# Altium schematic sheet Decawave.SchDoc
size A
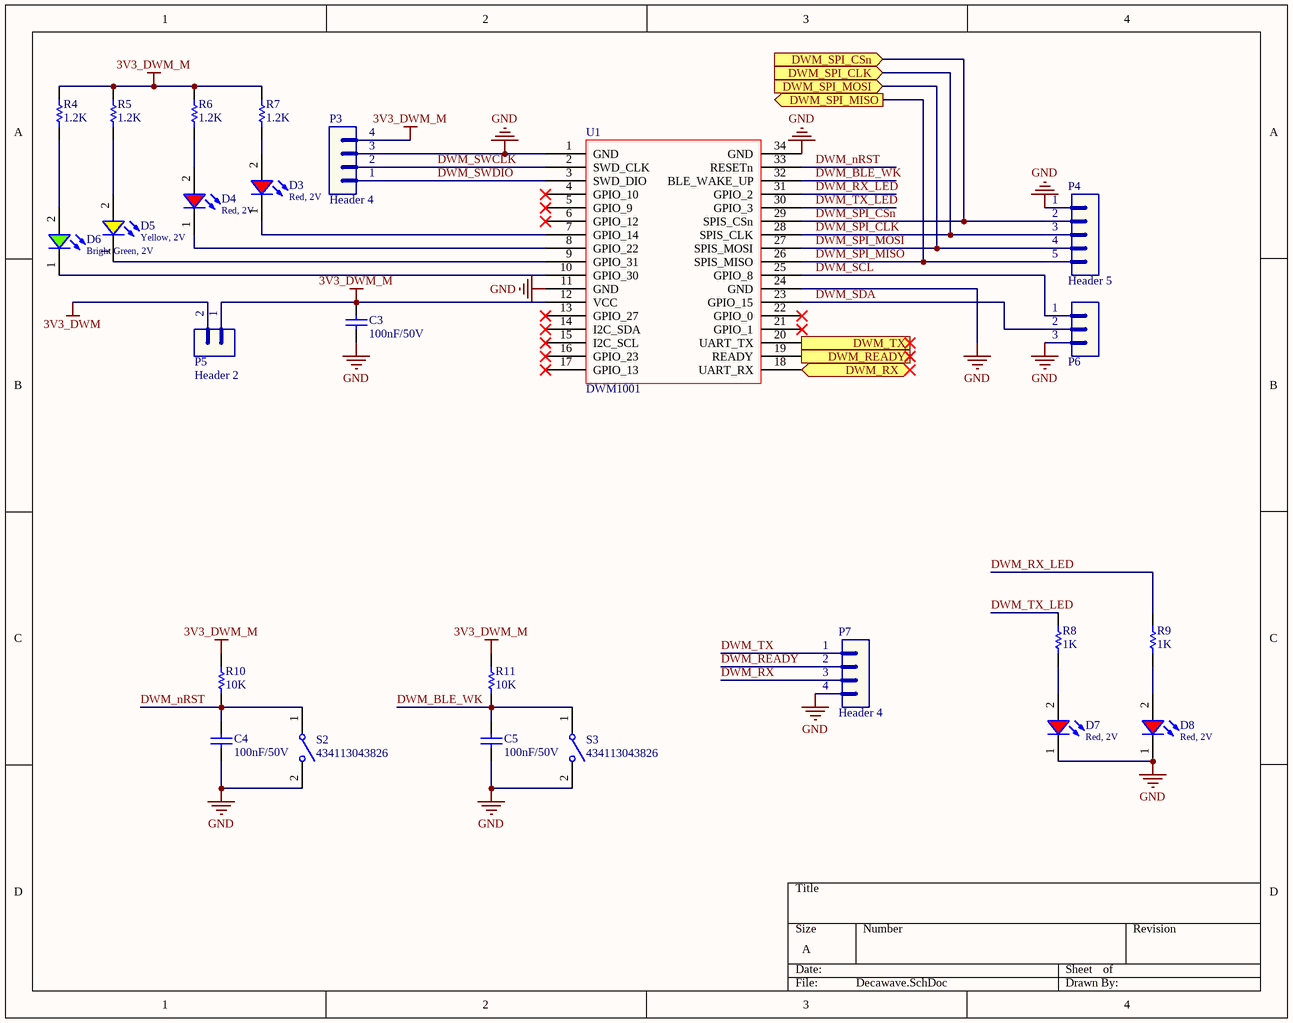
[diagram p0: Decawave.SchDoc]

## Parts
C3  value 100nF/50V  [CAP-SM-0805]  (hidden comment: Cap-100nF-50V-0805)
C4  value 100nF/50V  [CAP-SM-0805]  (hidden comment: Cap-100nF-50V-0805)
C5  value 100nF/50V  [CAP-SM-0805]  (hidden comment: Cap-100nF-50V-0805)
D3  Red, 2V  [WL-SMCW_0805]
D4  Red, 2V  [WL-SMCW_0805]
D5  Yellow, 2V  [WL-SMCW_0805]
D6  Bright Green, 2V  [WL-SMCW_0805]
D7  Red, 2V  [WL-SMCW_0805]
D8  Red, 2V  [WL-SMCW_0805]
P3  Header 4  [JP4]
P4  Header 5  [JP5]
P5  Header 2  [JP2]
P6  Header 3  [JP3]  (value not drawn)
P7  Header 4  [JP4]
R4  value 1.2K  [RES-SM-0805]  (hidden comment: Res-1.2K-0805)
R5  value 1.2K  [RES-SM-0805]  (hidden comment: Res-1.2K-0805)
R6  value 1.2K  [RES-SM-0805]  (hidden comment: Res-1.2K-0805)
R7  value 1.2K  [RES-SM-0805]  (hidden comment: Res-1.2K-0805)
R8  value 1K  [RES-SM-0805]  (hidden comment: Res-1K-0805)
R9  value 1K  [RES-SM-0805]  (hidden comment: Res-1K-0805)
R10  value 10K  [RES-SM-0805]  (hidden comment: Res-10k-0805)
R11  value 10K  [RES-SM-0805]  (hidden comment: Res-10k-0805)
S2  434113043826  [434113043826]
S3  434113043826  [434113043826]
U1  DWM1001  [DWM1001]

## Ports
DWM_READY, DWM_RX (bidir), DWM_SPI_CLK (in), DWM_SPI_CSn (in), DWM_SPI_MISO (out), DWM_SPI_MOSI (in), DWM_TX

## Nets
3V3_DWM: P5.2
3V3_DWM_M: C3.2 P3.4 P5.1 R4.2 R5.2 R6.2 R7.2 R10.1 R11.1 U1.12(VCC)
GND: C3.1 C4.1 C5.1 D7.1(K) D8.1(K) P3.3 P4.1 P6.3 P7.4 S2.2 S3.2 U1.1(GND) U1.11(GND) U1.24(GND) U1.34(GND)
DWM_BLE_WK: C5.2 R11.2 S3.1 U1.32(BLE_WAKE_UP)
DWM_nRST: C4.2 R10.2 S2.1 U1.33(RESETn)
DWM_READY: U1.19(READY) ; port DWM_READY
DWM_READY: P7.2  [a separate net that carries the same name]
DWM_RX: U1.18(UART_RX) ; port DWM_RX
DWM_RX: P7.3  [a separate net that carries the same name]
DWM_RX_LED: R9.2 U1.31(GPIO_2)
DWM_SCL: P6.1 U1.25(GPIO_8)
DWM_SDA: P6.2 U1.23(GPIO_15)
DWM_SPI_CLK: P4.3 U1.28(SPIS_CLK) ; port DWM_SPI_CLK
DWM_SPI_CSn: P4.2 U1.29(SPIS_CSn) ; port DWM_SPI_CSn
DWM_SPI_MISO: P4.5 U1.26(SPIS_MISO) ; port DWM_SPI_MISO
DWM_SPI_MOSI: P4.4 U1.27(SPIS_MOSI) ; port DWM_SPI_MOSI
DWM_SWCLK: P3.2 U1.2(SWD_CLK)
DWM_SWDIO: P3.1 U1.3(SWD_DIO)
DWM_TX: U1.20(UART_TX) ; port DWM_TX
DWM_TX: P7.1  [a separate net that carries the same name]
DWM_TX_LED: R8.2 U1.30(GPIO_3)
NetD3_1: D3.1(K) U1.7(GPIO_14)
NetD3_2: D3.2(A) R7.1
NetD4_1: D4.1(K) U1.8(GPIO_22)
NetD4_2: D4.2(A) R6.1
NetD5_1: D5.1(K) U1.9(GPIO_31)
NetD5_2: D5.2(A) R5.1
NetD6_1: D6.1(K) U1.10(GPIO_30)
NetD6_2: D6.2(A) R4.1
NetD7_2: D7.2(A) R8.1
NetD8_2: D8.2(A) R9.1

Not connected (* = marked no-connect by the designer): U1 4(GPIO_10)* 5(GPIO_9)* 6(GPIO_12)* 13(GPIO_27)* 14(I2C_SDA)* 15(I2C_SCL)* 16(GPIO_23)* 17(GPIO_13)* 21(GPIO_1)* 22(GPIO_0)*

## Library data of the parts
C3-C5 = Cap-100nF-50V-0805: CAP CER 0.1UF 50V Y5V 0805; Manufacturer: Samsung Electro-Mechanics; Manufacturer Part Number: CL21F104ZBCNNNC; Local Supplier: thegioiic; Local Supplier Link: https://thegioiic.com/products/tu-100nf-0-1uf-50v-0805; Supplier 1: Digikey; Supplier 1 Part Number: 1276-1007-1-ND; Supplier 1 Link: https://www.digikey.com/product-detail/en/samsung-electro-mechanics/CL21F104ZBCNNNC/1276-1007-1-ND/3889093
D3 D4 D7 D8 = 150080RS75000: WL-SMCW SMT Mono-color Chip LED Waterclear, size 0805, Red, 2V, 140deg; Chip Technology: AlInGaP; Dominant Wavelength typ.: 625nm; Luminous Intensity typ.: 150mcd; Peak Wavelength typ.: 630nm; Viewing Angle: 140deg; ComponentLink1Description: Manufacturer; ComponentLink1URL: http://www.we-online.de; ComponentLink2URL: https://www.we-online.com/catalog/datasheet/150080RS75000.pdf; ComponentLink2Description: Datasheet; Forward Voltage typ.: 2V; Emitting Color: Red; Mounting Technology: SMT; Operating Temperature: -40 to +85degC; Published Date: December 2019; Part Number: 150080RS75000; Packaging: Tape and Reel; Size: 0805; Publisher: Wurth Elektronik
D5 = 150080YS75000: WL-SMCW SMT Mono-color Chip LED Waterclear, size 0805, Yellow, 2V, 140deg; Chip Technology: AlInGaP; Dominant Wavelength typ.: 590nm; Luminous Intensity typ.: 120mcd; Peak Wavelength typ.: 595nm; Viewing Angle: 140deg; ComponentLink1Description: Manufacturer; ComponentLink1URL: http://www.we-online.de; ComponentLink2URL: https://www.we-online.com/catalog/datasheet/150080YS75000.pdf; ComponentLink2Description: Datasheet; Forward Voltage typ.: 2V; Emitting Color: Yellow; Mounting Technology: SMT; Operating Temperature: -40 to +85degC; Published Date: December 2019; Part Number: 150080YS75000; Packaging: Tape and Reel; Size: 0805; Publisher: Wurth Elektronik
D6 = 150080VS75000: WL-SMCW SMT Mono-color Chip LED Waterclear, size 0805, Bright Green, 2V, 140deg; Chip Technology: AlInGaP; Dominant Wavelength typ.: 570nm; Luminous Intensity typ.: 40mcd; Peak Wavelength typ.: 572nm; Viewing Angle: 140deg; ComponentLink1Description: Manufacturer; ComponentLink1URL: http://www.we-online.de; ComponentLink2URL: https://www.we-online.com/catalog/datasheet/150080VS75000.pdf; ComponentLink2Description: Datasheet; Forward Voltage typ.: 2V; Emitting Color: Bright Green; Mounting Technology: SMT; Operating Temperature: -40 to +85degC; Published Date: December 2019; Part Number: 150080VS75000; Packaging: Tape and Reel; Size: 0805; Publisher: Wurth Elektronik
P3 P7 = Header 4: Header, 4-Pin; LatestRevisionDate: 17-Jul-2002; LatestRevisionNote: Re-released for DXP Platform.; Publisher: Altium Limited
P4 = Header 5: Header, 5-Pin; LatestRevisionDate: 17-Jul-2002; LatestRevisionNote: Re-released for DXP Platform.; Publisher: Altium Limited
P5 = Header 2: Header, 2-Pin; LatestRevisionDate: 17-Jul-2002; LatestRevisionNote: Re-released for DXP Platform.; Publisher: Altium Limited
P6 = Header 3: Header, 3-Pin; LatestRevisionDate: 17-Jul-2002; LatestRevisionNote: Re-released for DXP Platform.; Publisher: Altium Limited
R4-R7 = Res-1.2K-0805: RES SMD 1.2K OHM 1% 1/8W 0805; Manufacturer: TE Connectivity Passive Product; Manufacturer Part Number: CRG0805F1K2; Local Supplier: thegioiic; Local Supplier Link: https://thegioiic.com/products/dien-tro-1-2k-ohm-0805-5; Supplier 1: Digikey; Supplier 1 Link: https://www.digikey.com/product-detail/en/te-connectivity-passive-product/CRG0805F1K2/A126346CT-ND/7603401; Supplier 1 Part Number: A126346CT-ND
R8 R9 = Res-1K-0805: RES 1K OHM 1% 1/4W 0805; Manufacturer: Stackpole Electronics Inc; Manufacturer Part Number: RNCP0805FTD1K00; Local Supplier: thegioiic; Local Supplier Link: https://thegioiic.com/products/dien-tro-1k-ohm-0805-5; Supplier 1: Digikey; Supplier 1 Link: https://www.digikey.com/product-detail/en/stackpole-electronics-inc/RNCP0805FTD1K00/RNCP0805FTD1K00CT-ND/2240568; Supplier 1 Part Number: RNCP0805FTD1K00CT-ND
R10 R11 = Res-10k-0805: RES 10K OHM 1% 1/4W 0805; Manufacturer: Stackpole Electronics Inc; Manufacturer Part Number: RNCP0805FTD10K0; Local Supplier: thegioiic; Local Supplier Link: https://thegioiic.com/products/dien-tro-10k-ohm-0805-5; Supplier 1: Digikey; Supplier 1 Link: https://www.digikey.com/product-detail/en/stackpole-electronics-inc/RNCP0805FTD10K0/RNCP0805FTD10K0CT-ND/2240601; Supplier 1 Part Number: RNCP0805FTD10K0CT-ND
S2 S3 = 434113043826: WS-TASV J-Bend SMT Tact Switch 6x3.5mm, height 4.3mm, 260gf; Rated Voltage: 12VDC; Rated Current: 50mA; Washable: No; ComponentLink1Description: Manufacturer; ComponentLink1URL: http://www.we-online.de; ComponentLink2Description: Datasheet; ComponentLink2URL: https://katalog.we-online.com/em/datasheet/434113043826.pdf; Operating Temperature: -40 to +85degC; Part Number: 434113043826; Published Date: September 2019; Contact Material: Stainless Steel; Height: 4.3mm; Mounting Technology: SMT; Contact Plating: Silver; Operation Force: 260gf; Packaging: Tape and Reel; Terminal Material: Copper Alloy; Publisher: Wurth Elektronik; Terminal Plating: Silver